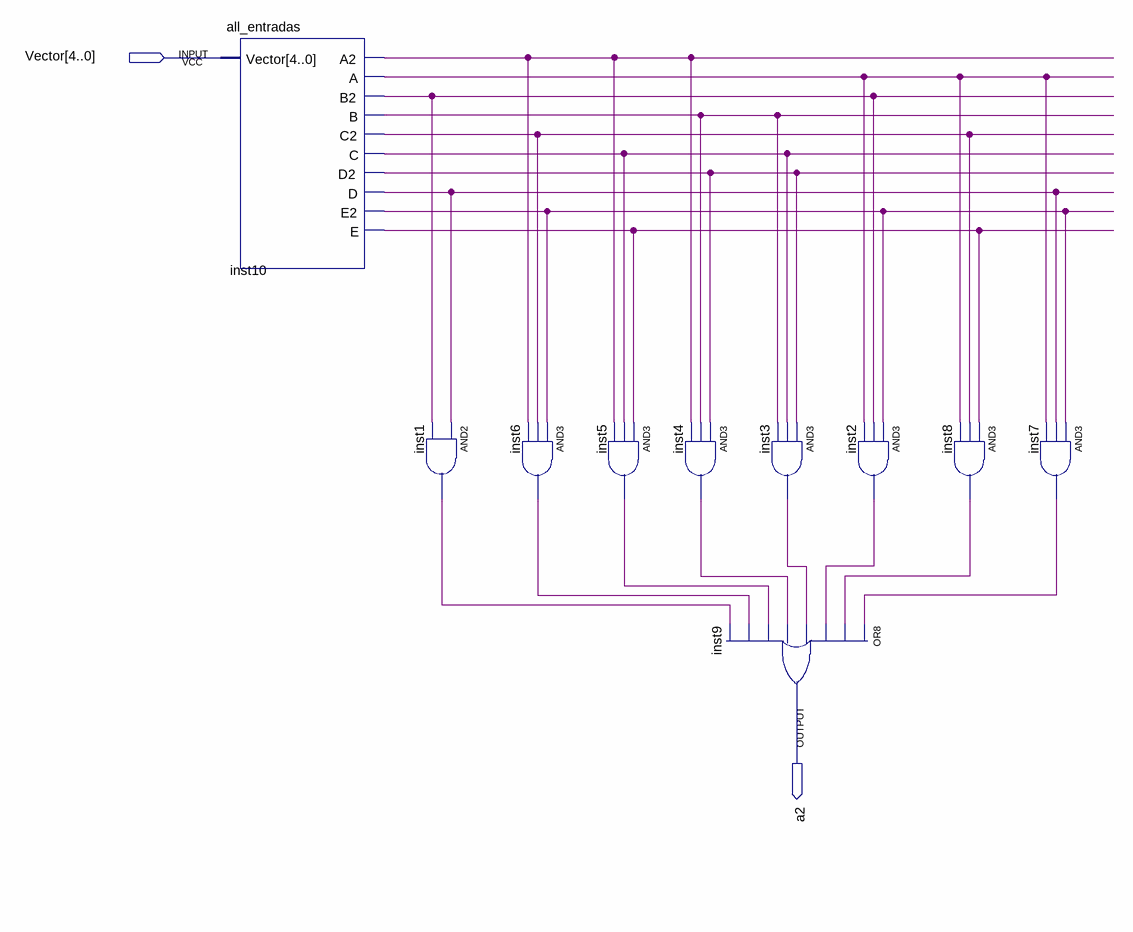
[diagram p0: schematic sheet]
// Quartus schematic a2.bdf as structural Verilog: 10 symbols, 2 pins
module a2 (
  input  [4:0] Vector,
  output a2
);

  wire inst1_out, inst2_out, inst3_out, inst4_out, inst5_out, inst6_out, inst7_out, inst8_out, inst10_a,
       inst10_a2, inst10_b, inst10_b2, inst10_c, inst10_c2, inst10_d, inst10_d2, inst10_e, inst10_e2;

  all_entradas inst10 (
    .Vector(Vector), .A2(inst10_a2), .A(inst10_a), .B2(inst10_b2), .B(inst10_b), .C2(inst10_c2),
    .C(inst10_c), .D2(inst10_d2), .D(inst10_d), .E2(inst10_e2), .E(inst10_e));
  and inst1 (inst1_out, inst10_d, inst10_b2);
  and inst6 (inst6_out, inst10_e2, inst10_c2, inst10_a2);
  and inst5 (inst5_out, inst10_e, inst10_c, inst10_a2);
  and inst4 (inst4_out, inst10_d2, inst10_b, inst10_a2);
  and inst3 (inst3_out, inst10_d2, inst10_c, inst10_b);
  or inst9 (a2, inst7_out, inst8_out, inst2_out, inst3_out, inst4_out, inst5_out, inst6_out, inst1_out);
  and inst2 (inst2_out, inst10_e2, inst10_b2, inst10_a);
  and inst8 (inst8_out, inst10_e, inst10_c2, inst10_a);
  and inst7 (inst7_out, inst10_e2, inst10_d, inst10_a);
endmodule
